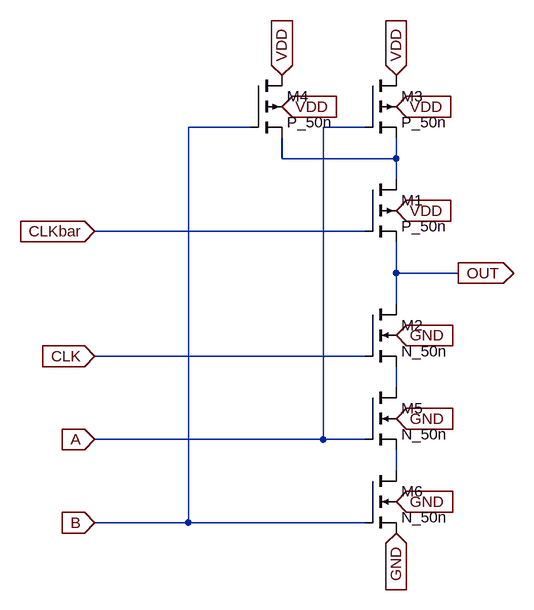
[diagram p0: schematic TristateNAND2.asc]
TristateNAND2.asc, the LTspice schematic file:
Version 4.1
SHEET 1 880 680
WIRE 96 -128 0 -128
WIRE 272 -128 208 -128
WIRE 144 -80 144 -112
WIRE 320 -80 320 -112
WIRE 320 -80 144 -80
WIRE 320 -48 320 -80
WIRE 272 32 -144 32
WIRE 320 96 320 48
WIRE 416 96 320 96
WIRE 320 144 320 96
WIRE 272 224 -144 224
WIRE 320 272 320 240
WIRE 208 352 208 -128
WIRE 208 352 -144 352
WIRE 272 352 208 352
WIRE 320 400 320 368
WIRE 0 480 0 -128
WIRE 0 480 -144 480
WIRE 272 480 0 480
FLAG 144 -208 VDD
IOPIN 144 -208 In
FLAG 144 -160 VDD
IOPIN 144 -160 In
FLAG 320 -160 VDD
IOPIN 320 -160 In
FLAG 320 -208 VDD
IOPIN 320 -208 In
FLAG 320 0 VDD
IOPIN 320 0 In
FLAG 416 96 OUT
IOPIN 416 96 Out
FLAG 320 192 GND
IOPIN 320 192 In
FLAG 320 320 GND
IOPIN 320 320 In
FLAG 320 448 GND
IOPIN 320 448 In
FLAG 320 496 GND
IOPIN 320 496 In
FLAG -144 480 B
IOPIN -144 480 In
FLAG -144 352 A
IOPIN -144 352 In
FLAG -144 224 CLK
IOPIN -144 224 In
FLAG -144 32 CLKbar
IOPIN -144 32 In
SYMBOL pmos4 272 -48 R0
SYMATTR InstName M1
SYMATTR Value2 l=50n w=12u
SYMATTR Value P_50n
SYMBOL nmos4 272 144 R0
SYMATTR InstName M2
SYMATTR Value2 l=50n w=6u
SYMATTR Value N_50n
SYMBOL pmos4 272 -208 R0
SYMATTR InstName M3
SYMATTR Value2 l=50n w=12u
SYMATTR Value P_50n
SYMBOL pmos4 96 -208 R0
SYMATTR InstName M4
SYMATTR Value2 l=50n w=12u
SYMATTR Value P_50n
SYMBOL nmos4 272 272 R0
SYMATTR InstName M5
SYMATTR Value2 l=50n w=6u
SYMATTR Value N_50n
SYMBOL nmos4 272 400 R0
SYMATTR InstName M6
SYMATTR Value2 l=50n w=6u
SYMATTR Value N_50n

The netlist it stands for:
* TristateNAND2.asc
M1 N001 CLKbar OUT VDD P_50n l=50n w=12u
M2 OUT CLK N002 GND N_50n l=50n w=6u
M3 VDD A N001 VDD P_50n l=50n w=12u
M4 VDD B N001 VDD P_50n l=50n w=12u
M5 N002 A N003 GND N_50n l=50n w=6u
M6 N003 B GND GND N_50n l=50n w=6u
.model NMOS NMOS
.model PMOS PMOS
.lib standard.mos
.backanno
.end